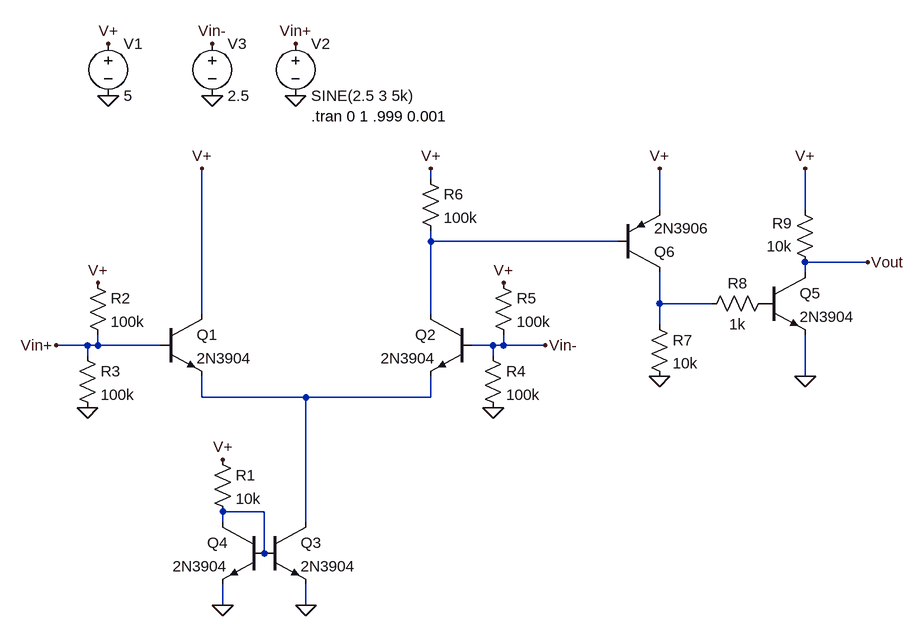
[diagram p0: schematic 08H-06.asc]
08H-06.asc, the LTspice schematic file:
Version 4.1
SHEET 1 1384 680
WIRE 640 -176 640 -192
WIRE 992 -128 992 -192
WIRE 1216 -128 1216 -192
WIRE 640 -80 640 -96
WIRE 928 -80 640 -80
WIRE 1312 -48 1216 -48
WIRE 1216 -32 1216 -48
WIRE 992 16 992 -32
WIRE 1072 16 992 16
WIRE 288 32 288 -192
WIRE 640 32 640 -80
WIRE 992 48 992 16
WIRE 112 80 64 80
WIRE 128 80 128 64
WIRE 128 80 112 80
WIRE 224 80 128 80
WIRE 736 80 704 80
WIRE 752 80 752 64
WIRE 752 80 736 80
WIRE 816 80 752 80
WIRE 112 96 112 80
WIRE 736 96 736 80
WIRE 1216 128 1216 64
WIRE 288 160 288 128
WIRE 448 160 288 160
WIRE 640 160 640 128
WIRE 640 160 448 160
WIRE 384 336 320 336
WIRE 320 352 320 336
WIRE 448 352 448 160
WIRE 384 400 384 336
WIRE 320 480 320 448
WIRE 448 480 448 448
FLAG 144 -304 0
FLAG 432 -304 0
FLAG 432 -384 Vin+
FLAG 144 -384 V+
FLAG 320 256 V+
FLAG 992 128 0
FLAG 736 176 0
FLAG 112 176 0
FLAG 320 480 0
FLAG 448 480 0
FLAG 128 -16 V+
FLAG 288 -192 V+
FLAG 640 -192 V+
FLAG 992 -192 V+
FLAG 1216 -192 V+
FLAG 752 -16 V+
FLAG 1216 128 0
FLAG 64 80 Vin+
FLAG 816 80 Vin-
FLAG 304 -304 0
FLAG 304 -384 Vin-
FLAG 1312 -48 Vout
SYMBOL voltage 144 -400 R0
WINDOW 123 0 0 Left 0
WINDOW 39 0 0 Left 0
SYMATTR InstName V1
SYMATTR Value 5
SYMBOL voltage 432 -400 R0
WINDOW 123 24 44 Left 2
WINDOW 39 0 0 Left 0
SYMATTR InstName V2
SYMATTR Value SINE(2.5 3 5k)
SYMBOL npn 224 32 R0
SYMATTR InstName Q1
SYMATTR Value 2N3904
SYMBOL npn 704 32 M0
SYMATTR InstName Q2
SYMATTR Value 2N3904
SYMBOL npn 384 352 R0
SYMATTR InstName Q3
SYMATTR Value 2N3904
SYMBOL npn 384 352 M0
SYMATTR InstName Q4
SYMATTR Value 2N3904
SYMBOL res 304 240 R0
SYMATTR InstName R1
SYMATTR Value 10k
SYMBOL res 112 -32 R0
SYMATTR InstName R2
SYMATTR Value 100k
SYMBOL res 96 80 R0
SYMATTR InstName R3
SYMATTR Value 100k
SYMBOL res 720 80 R0
SYMATTR InstName R4
SYMATTR Value 100k
SYMBOL res 736 -32 R0
SYMATTR InstName R5
SYMATTR Value 100k
SYMBOL res 624 -192 R0
SYMATTR InstName R6
SYMATTR Value 100k
SYMBOL res 976 32 R0
SYMATTR InstName R7
SYMATTR Value 10k
SYMBOL res 1168 0 R90
WINDOW 0 0 56 VBottom 2
WINDOW 3 32 56 VTop 2
SYMATTR InstName R8
SYMATTR Value 1k
SYMBOL res 1232 -32 R180
WINDOW 0 36 76 Left 2
WINDOW 3 36 40 Left 2
SYMATTR InstName R9
SYMATTR Value 10k
SYMBOL npn 1152 -32 R0
SYMATTR InstName Q5
SYMATTR Value 2N3904
SYMBOL pnp 928 -32 M180
SYMATTR InstName Q6
SYMATTR Value 2N3906
SYMBOL voltage 304 -400 R0
WINDOW 123 0 0 Left 0
WINDOW 39 0 0 Left 0
SYMATTR InstName V3
SYMATTR Value 2.5
TEXT 456 -272 Left 2 !.tran 0 1 .999 0.001

The netlist it stands for:
* 08H-06.asc
V1 V+ 0 5
V2 Vin+ 0 SINE(2.5 3 5k)
Q1 V+ Vin+ N003 0 2N3904
Q2 N001 Vin- N003 0 2N3904
Q3 N003 N004 0 0 2N3904
Q4 N004 N004 0 0 2N3904
R1 V+ N004 10k
R2 V+ Vin+ 100k
R3 Vin+ 0 100k
R4 Vin- 0 100k
R5 V+ Vin- 100k
R6 V+ N001 100k
R7 N002 0 10k
R8 P001 N002 1k
R9 Vout V+ 10k
Q5 Vout P001 0 0 2N3904
Q6 N002 N001 V+ 0 2N3906
V3 Vin- 0 2.5
.model NPN NPN
.model PNP PNP
.lib standard.bjt
.tran 0 1 .999 0.001
.backanno
.end